# Altium schematic sheet can_transciever_dualvolt_isolated.SchDoc: Dual Isolated CAN transciever
size A4; Organization: UNSW Solar Racing Team; Address3: UNSW; Address4: Sydney NSW 2052; Address2: Electrical Engineering; Address1: Rm 109
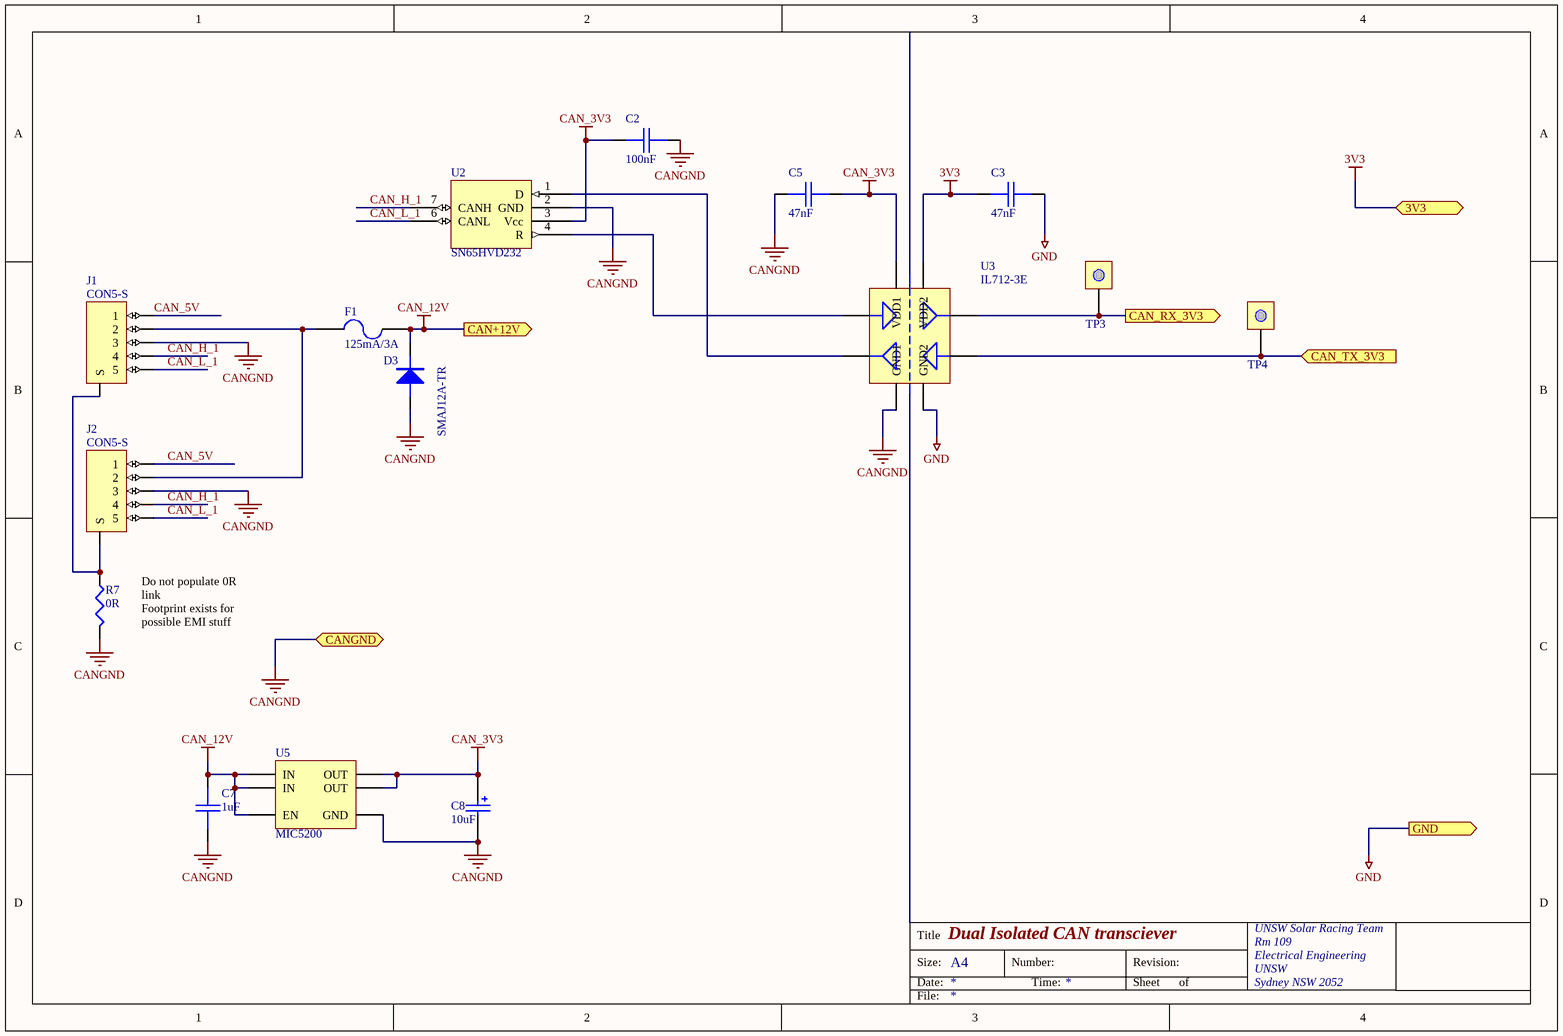
[diagram p0: can_transciever_dualvolt_isolated.SchDoc]

## Parts
C2  100nF  [0603]
C3  47nF  [0603]
C5  47nF  [0603]
C7  1uF  [0805]
C8  10uF  [MCCT-CASEA]
D3  SMAJ12A-TR  [SMA]
F1  125mA/3A  [LITTELFUSE-154]
J1  CON5-S  [TRIAD5F]
J2  CON5-S  [TRIAD5F]
R7  0R  [1206]
TP3  RX  [TESTPOINT]  (value not drawn)
TP4  TX  [TESTPOINT]  (value not drawn)
U2  SN65HVD232  [SO8]
U3  IL712-3E  [SO8]
U5  MIC5200  [SO8]

## Ports
3V3, CAN+12V (out), CAN_RX_3V3 (out), CAN_TX_3V3 (in), CANGND, GND (out)

## Nets
3V3: C3.1 U3.8(VDD2) ; port 3V3
CAN_3V3: C2.1 C5.2 C8.1 U2.3(Vcc) U3.1(VDD1) U5.1(OUT) U5.2(OUT)
CAN_12V: C7.1 D3.K F1.2 U5.5(EN) U5.7(IN) U5.8(IN) ; port CAN+12V
CANGND: C2.2 C5.1 C7.2 C8.2 D3.A J1.3 J2.3 R7.2 U2.2(GND) U3.4(GND1) U5.4(GND) ; port CANGND
GND: C3.2 U3.5(GND2) ; port GND
CAN_5V: J1.1 J2.1
CAN_H_1: J1.4 J2.4 U2.7(CANH)
CAN_L_1: J1.5 J2.5 U2.6(CANL)
CAN_RX_3V3: TP3.0(TP) U3.7(OUT1) ; port CAN_RX_3V3
CAN_TX_3V3: TP4.0(TP) U3.6(IN2) ; port CAN_TX_3V3
NetF1_1: F1.1 J1.2 J2.2
NetJ1_0: J1.0(S) J2.0(S) R7.1
NetU2_1: U2.1(D) U3.3(OUT2)
NetU2_4: U2.4(R) U3.2(IN1)

## Notes on the sheet
- Do not populate 0R link
  Footprint exists for possible EMI stuff
- Title
- Size:
- Date:
- A4
- Number:
- Time:
- Revision:
- Sheet
- of
- File:

## Library data of the parts
C2 C3 C5 C7 = CAP: Capacitor
  C3 C5: Farnell: 8820015; Digikey: 490-3287-1-ND; DigikeyPrice: 0.053; FarnellPrice: 0.085
C8 = CAP POL3: Polarized Capacitor (Surface Mount); Revision: July-2002: Re-released for DXP Platform.; Digikey: 399-3687-1-ND; DigikeyPrice: 0.54; Farnell: 1650980; FarnellPrice: 0.786
D3 = DIODE: 12V TVS Diode; Farnell: 9802754; FarnellPrice: 0.502; Digikey: 497-6503-1-ND; DigikeyPrice: 0.61
F1 = FUSE2: Fuse; Farnell: 9943749; FarnellPrice: 5.82; Digikey: F1307CT-ND; DigikeyPrice: 3.49
J1 J2 = CON5-S: Connector, 2 pin, with shield @ S; RS: 259-0993; RSPrice: 26.2; Farnell: 131-040; FarnellPrice: 32.75
R7 = RES1: Resistor
TP3 TP4 = TEST: TEST POINT
U2 = SN65HVD232: 3.3V CAN Transciever; Farnell: 1103107; FarnellPrice: 5.1; Digikey: 296-12282-5-ND; DigikeyPrice: 3.36
U3 = IL712: IL712 Optical Isolator; Digikey: 390-1061-5-ND; DigikeyPrice: 5.86; Farnell: 9570608; FarnellPrice: 9.4
U5 = MIC5200: MIC5200 - SO8; Part Field 2: 2.00; Part Field 3: Computer Science and Engineering; Part Field 4: David Johnson; Farnell: 1213488; FarnellPrice: 3.62; Digikey: 576-1246-ND; DigikeyPrice: 2.1